# EAGLE design galgas-didacticas (EAGLE 7.5.0)
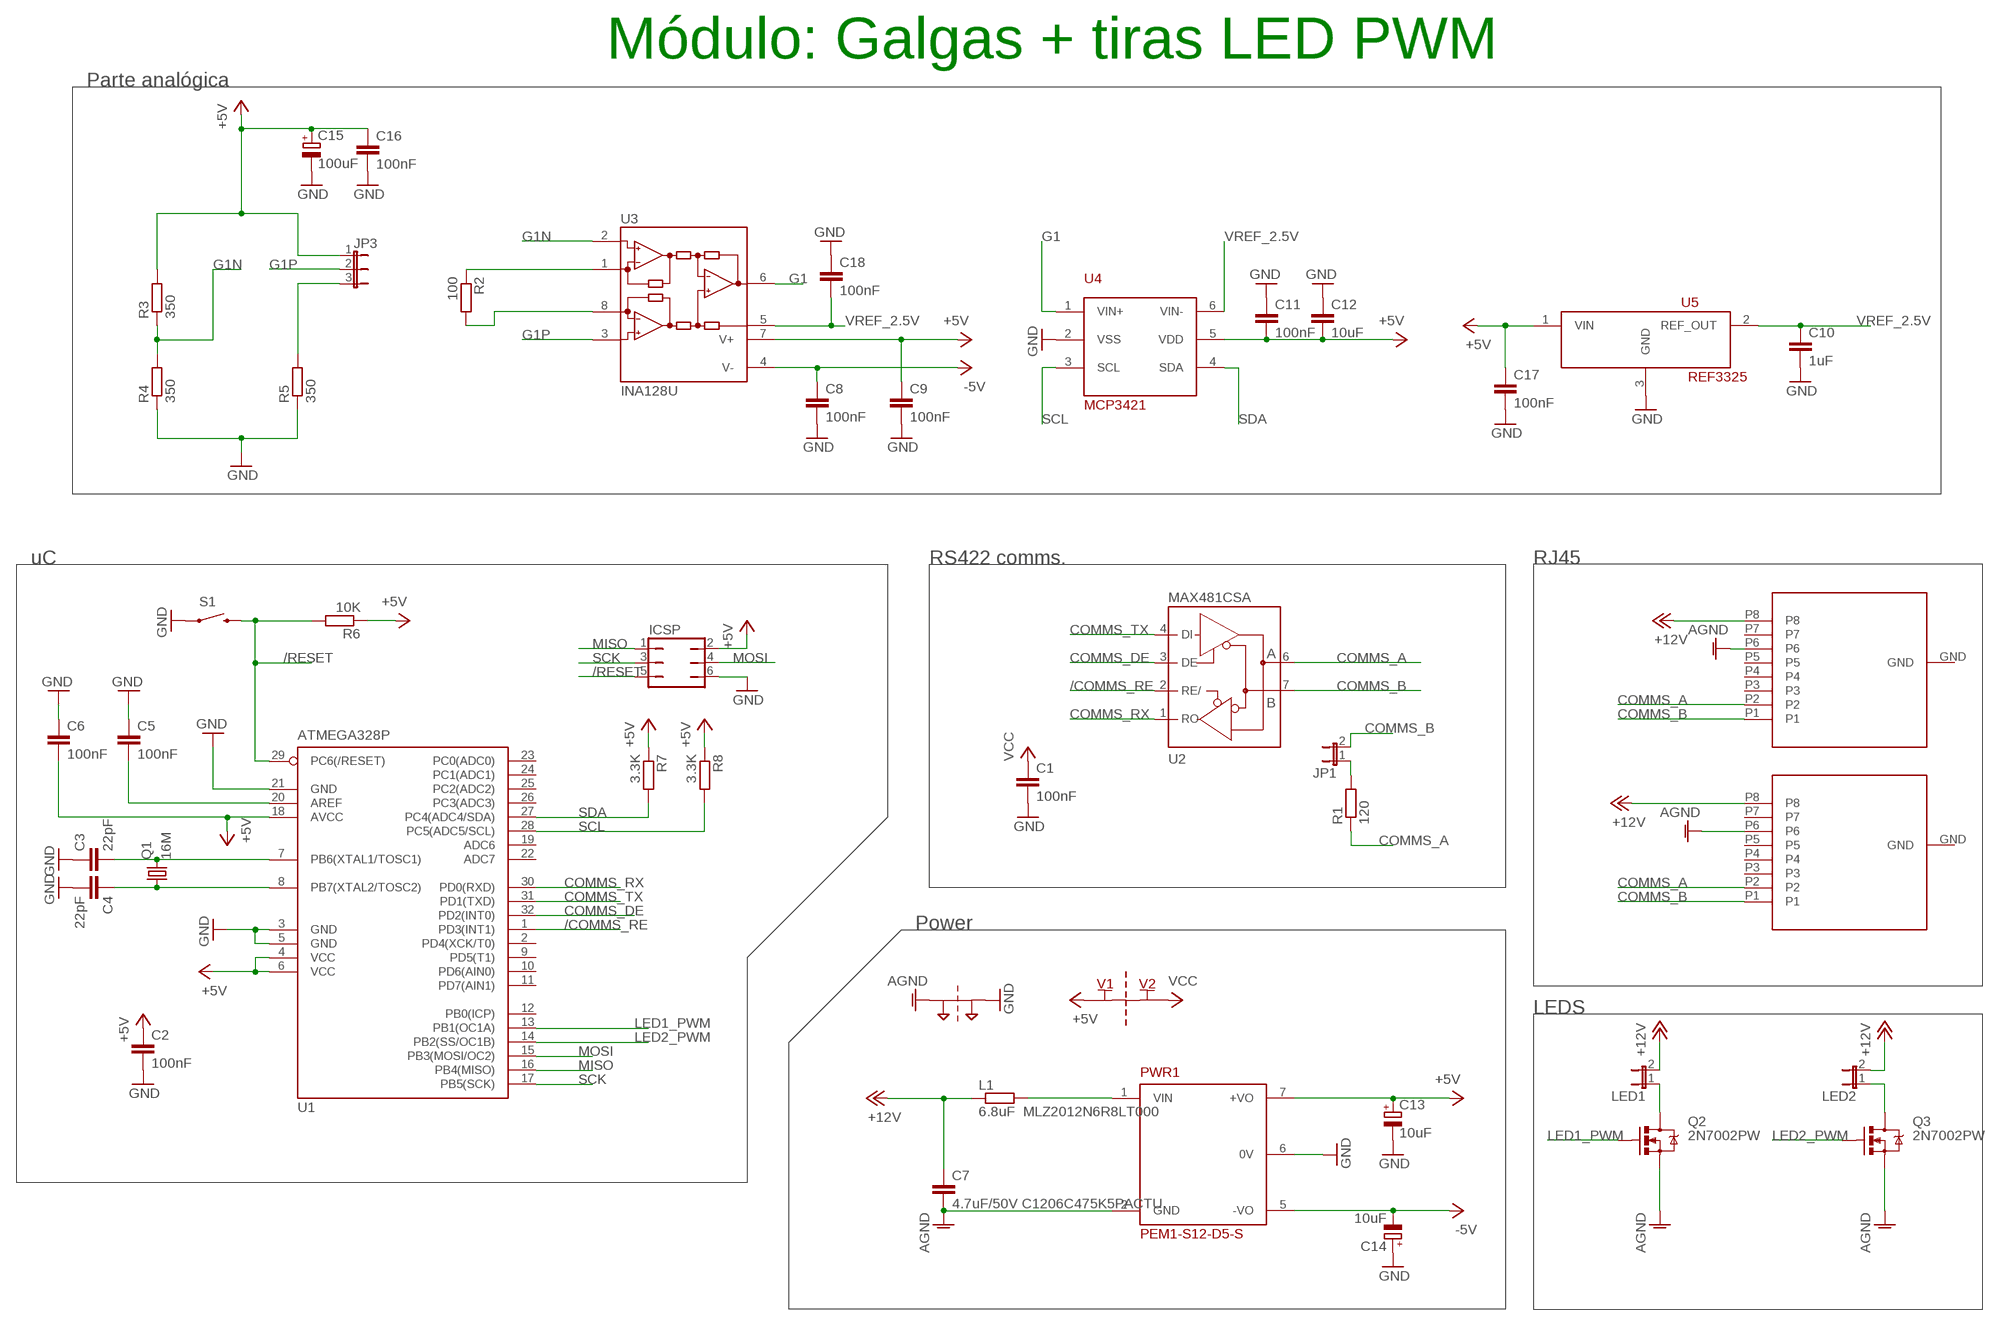
[diagram p0: schematic, sheet 1]

## Parts
C1  100nF  C-EUC0805  [C0805]
C2  100nF  C-EUC0805  [C0805]
C3  22pF  C-EUC0805  [C0805]
C4  22pF  C-EUC0805  [C0805]
C5  100nF  C-EUC0805  [C0805]
C6  100nF  C-EUC0805  [C0805]
C7  4.7uF/50V C1206C475K5PACTU  C-EUC1206K  [C1206K]
C8  100nF  C-EUC0805  [C0805]
C9  100nF  C-EUC0805  [C0805]
C10  1uF  C-EUC0805  [C0805]
C11  100nF  C-EUC0805  [C0805]
C12  10uF  C-EUC0805  [C0805]
C13  10uF  CPOL-EU153CLV-0505  [153CLV-0505]
C14  10uF  CPOL-EU153CLV-0505  [153CLV-0505]
C15  100uF  CPOL-EU153CLV-0505  [153CLV-0505]
C16  100nF  C-EUC0805  [C0805]
C17  100nF  C-EUC0805  [C0805]
C18  100nF  C-EUC0805  [C0805]
ICSP  JP3Q  [JP3Q]
J1  RJ45_DIRECT  [RJ45_DIRECT]
J2  RJ45_DIRECT  [RJ45_DIRECT]
JP1  JP1E  [JP1]
JP3  JP2E  [JP2]
L1  6.8uF MLZ2012N6R8LT000  R-EU_R0805W  [R0805W]
LED1  JP1E  [JP1]
LED2  JP1E  [JP1]
PT1  2PT_GND_TIE  [2PT_GND_TIE]
PWR1  PEM1-S12-D5-S  [PEM1-S]
Q1  16M  CRYSTALHC49UP  [HC49UP]
Q2  2N7002PW  MOSFET-NCHANNEL2N7002PW  [SOT323]
Q3  2N7002PW  MOSFET-NCHANNEL2N7002PW  [SOT323]
R1  120  R-EU_R0805W  [R0805W]
R2  100  R-EU_R0805W  [R0805W]
R3  350  R-EU_R1206W  [R1206W]
R4  350  R-EU_R1206W  [R1206W]
R5  350  R-EU_R1206W  [R1206W]
R6  10K  R-EU_R0805W  [R0805W]
R7  3.3K  R-EU_R0805W  [R0805W]
R8  3.3K  R-EU_R0805W  [R0805W]
S1  SWITCH-MOMENTARY-2PTH  [TACTILE-PTH]
U1  ATMEGA328P  MEGA8-AI  [TQFP32-08]
U2  MAX481CSA  [SO08]
U3  INA128U  [SO08]
U4  MCP3421  [SOT-23-6]
U5  REF3325  [SOT-23]
U$2  SUPPLY_CONNECT  [2PT_GND_TIE]

## Nets
+5V: C2.1 C6.2 C9.1 C11.2 C12.2 C13.+ C15.+ C16.1 C17.1 ICSP.2 JP3.1 PWR1.7(+VO) R3.2 R6.1 R7.1 R8.1 U1.4(VCC) U1.6(VCC) U1.18(AVCC) U3.7(V+) U4.5(VDD) U5.1(VIN) U$2.P$1
+12V: C7.1 J1.P8 J2.P8 L1.1 LED1.2 LED2.2
-5V: C8.1 C14.- PWR1.5(-VO) U3.4(V-)
/COMMS_RE: U1.1(PD3(INT1)) U2.2(RE/)
/RESET: ICSP.5 R6.2 S1.3 U1.29(PC6(/RESET))
AGND: C7.2 J1.P6 J2.P6 PT1.P$1 PWR1.2(GND) Q2.2(S) Q3.2(S)
COMMS_A: J1.P2 J2.P2 R1.1 U2.6(A)
COMMS_B: J1.P1 J2.P1 JP1.2 U2.7(B)
COMMS_DE: U1.32(PD2(INT0)) U2.3(DE)
COMMS_RX: U1.30(PD0(RXD)) U2.1(RO)
COMMS_TX: U1.31(PD1(TXD)) U2.4(DI)
G1: U3.6(OUT) U4.1(VIN+)
G1N: R3.1 R4.2 U3.2(-IN)
G1P: JP3.2 U3.3(+IN)
GND: C1.2 C2.2 C3.1 C4.2 C5.1 C6.1 C8.2 C9.2 C10.2 C11.1 C12.1 C13.- C14.+ C15.- C16.2 C17.2 C18.1 ICSP.6 PT1.P$2 PWR1.6(0V) R4.1 R5.1 S1.1 U1.3(GND) U1.5(GND) U1.21(GND) U4.2(VSS) U5.3(GND)
LED1_PWM: Q2.1(G) U1.13(PB1(OC1A))
LED2_PWM: Q3.1(G) U1.14(PB2(SS/OC1B))
MISO: ICSP.1 U1.16(PB4(MISO))
MOSI: ICSP.4 U1.15(PB3(MOSI/OC2))
N$1: JP1.1 R1.2
N$2: LED1.1 Q2.3(D)
N$3: C3.2 Q1.2 U1.7(PB6(XTAL1/TOSC1))
N$4: C4.1 Q1.1 U1.8(PB7(XTAL2/TOSC2))
N$5: C5.2 U1.20(AREF)
N$6: L1.2 PWR1.1(VIN)
N$7: R2.1 U3.1(RG)
N$8: R2.2 U3.8(RG)
N$9: LED2.1 Q3.3(D)
N$15: JP3.3 R5.2
SCK: ICSP.3 U1.17(PB5(SCK))
SCL: R8.2 U1.28(PC5(ADC5/SCL)) U4.3(SCL)
SDA: R7.2 U1.27(PC4(ADC4/SDA)) U4.4(SDA)
VCC: C1.1 U$2.P$2
VREF_2.5V: C10.1 C18.2 U3.5(REF) U4.6(VIN-) U5.2(REF_OUT)
Unconnected: J1.P3 J1.P4 J1.P5 J1.P7 J2.P3 J2.P4 J2.P5 J2.P7 U1.2(PD4(XCK/T0)) U1.9(PD5(T1)) U1.10(PD6(AIN0)) U1.11(PD7(AIN1)) U1.12(PB0(ICP)) U1.19(ADC6) U1.22(ADC7) U1.23(PC0(ADC0)) U1.24(PC1(ADC1)) U1.25(PC2(ADC2)) U1.26(PC3(ADC3))

## Notes on the sheet
- Módulo: Galgas + tiras LED PWM
- Parte analógica
- uC | RS422 comms. | RJ45
- Power
- LEDS

## Power pins joined to a net without a drawn wire
GND: J1.GND J2.GND U2.5(GND)
VCC: U2.8(VCC)

## Library data of the parts
C1-C12 C16-C18 = rcl:C-EU: CAPACITOR, European symbol
C13-C15 = rcl:CPOL-EU: POLARIZED CAPACITOR, European symbol
ICSP = jumper:JP3Q: JUMPER
J1 J2 = galgas_lib:RJ45_DIRECT
JP1 LED1 LED2 = jumper:JP1E: JUMPER
JP3 = jumper:JP2E: JUMPER
L1 R2 = rcl:R-EU_: RESISTOR, European symbol
PT1 = SparkFun-Passives:2PT_GND_TIE: Package for connecting two ground nets in one place.
PWR1 = galgas_lib:PEM1-S12-D5-S
Q1 = crystal:CRYSTAL: CRYSTAL; OC_FARNELL: unknown; OC_NEWARK: unknown
Q2 Q3 = SparkFun-DiscreteSemi:MOSFET-NCHANNEL: Common NMOSFET Parts MFG P/N Store ID Prod ID FDD8780 TRANS-09984 SI7820DN TRANS-11055 FDS6630A IC-08089 2N7002PW TRANS-11151 FQP30N06L COM-10213 TRANS-10060 BSS123LT1G TRANS-08345 BSS138 TRANS-00830 BS170 2N7000; PROD_ID: TRANS-11151
R1 R3-R8 = resistor:R-EU_: RESISTOR, European symbol
S1 = SparkFun-Electromechanical:SWITCH-MOMENTARY-2: Various NO switches- pushbuttons, reed, etc
U1 = atmel:MEGA8: MICROCONTROLLER 8 Kbytes FLASH, 1 kbytes SRAM, 512 bytes EEPROM, USART, 6-channel 10 bit ADC, 2-channel 8 bit ADC Pin compatible with Atmega48, ATMega88, ATMega168 Source: avr.lbr; MPN: ATMEGA8-16AU; OC_FARNELL: 9171371; OC_NEWARK: 73M8863
U2 = maxim:MAX481CSA: RS485 TRANSEIVER; MF: MAXIM; MPN: MAX481CSA; OC_FARNELL: unknown; OC_NEWARK: 90C3817
U3 = burr-brown:INA128: Instrumentation Amplifiers Precision, Low Power; MF: TEXAS INSTRUMENTS; MPN: INA128U; OC_FARNELL: 1212413; OC_NEWARK: 35C1729
U4 = galgas_lib:MCP3421: MCP3421 18-Bit Analog-to-Digital Converter with I2 C Interface and On-Board Reference
U5 = galgas_lib:REF3325
U$2 = SparkFun-Passives:SUPPLY_CONNECT

## Board
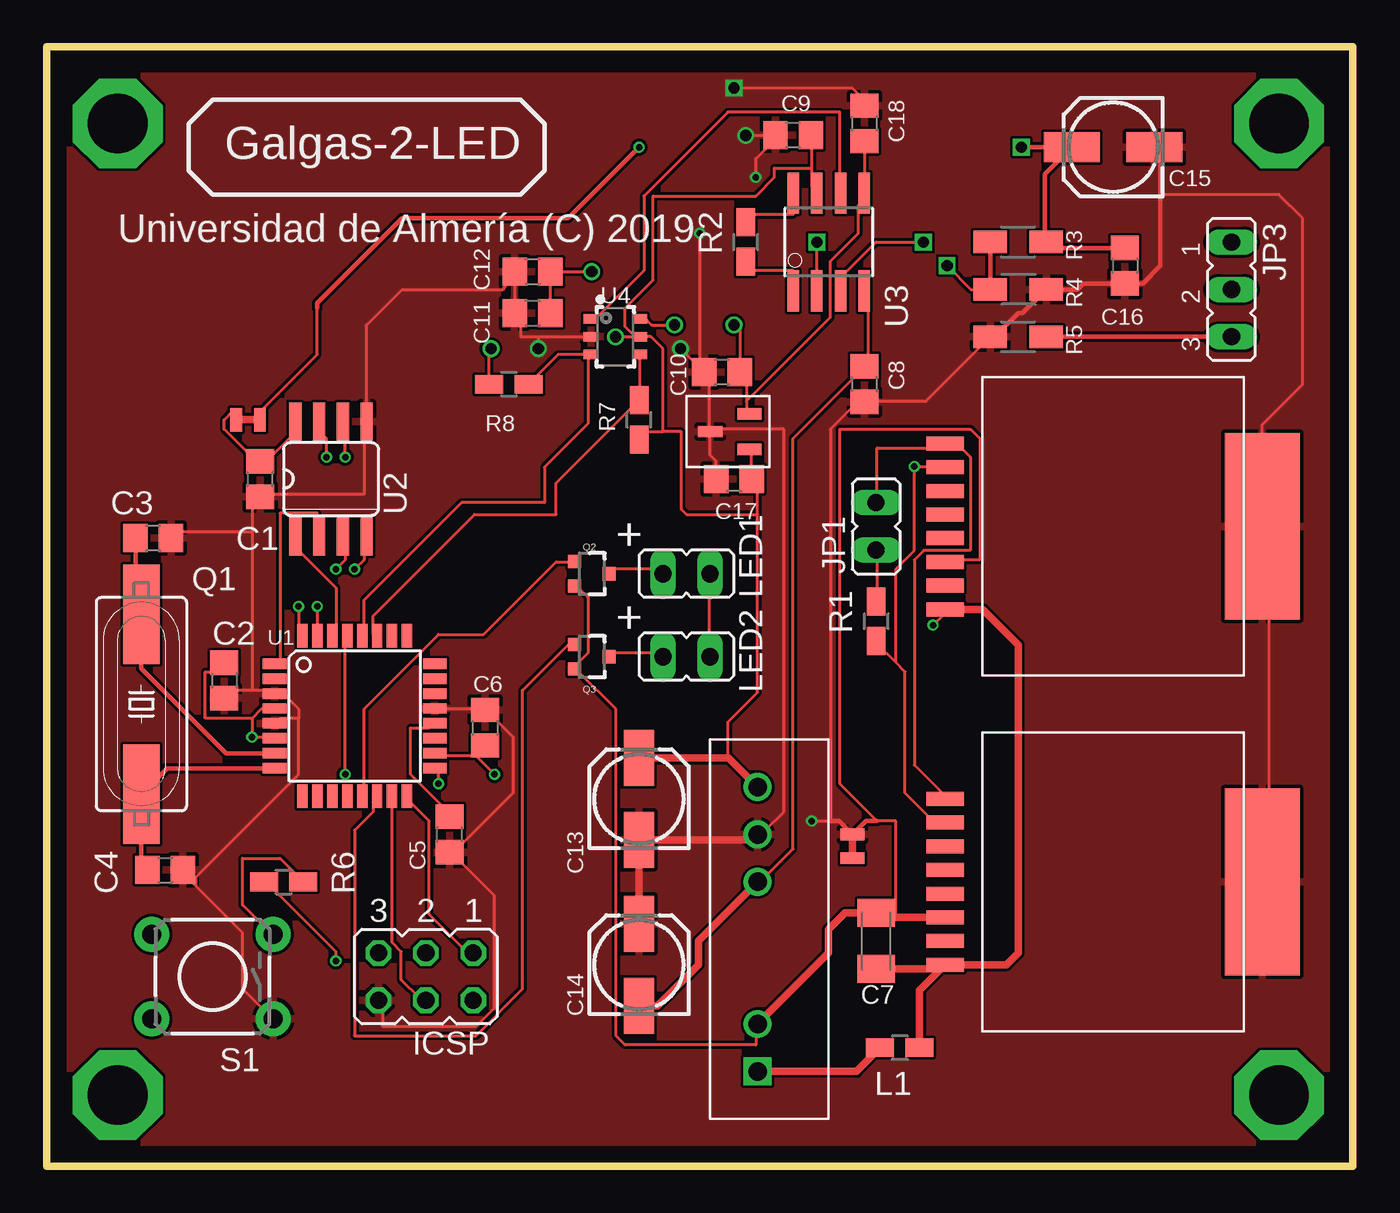
[diagram p1: board, top side]
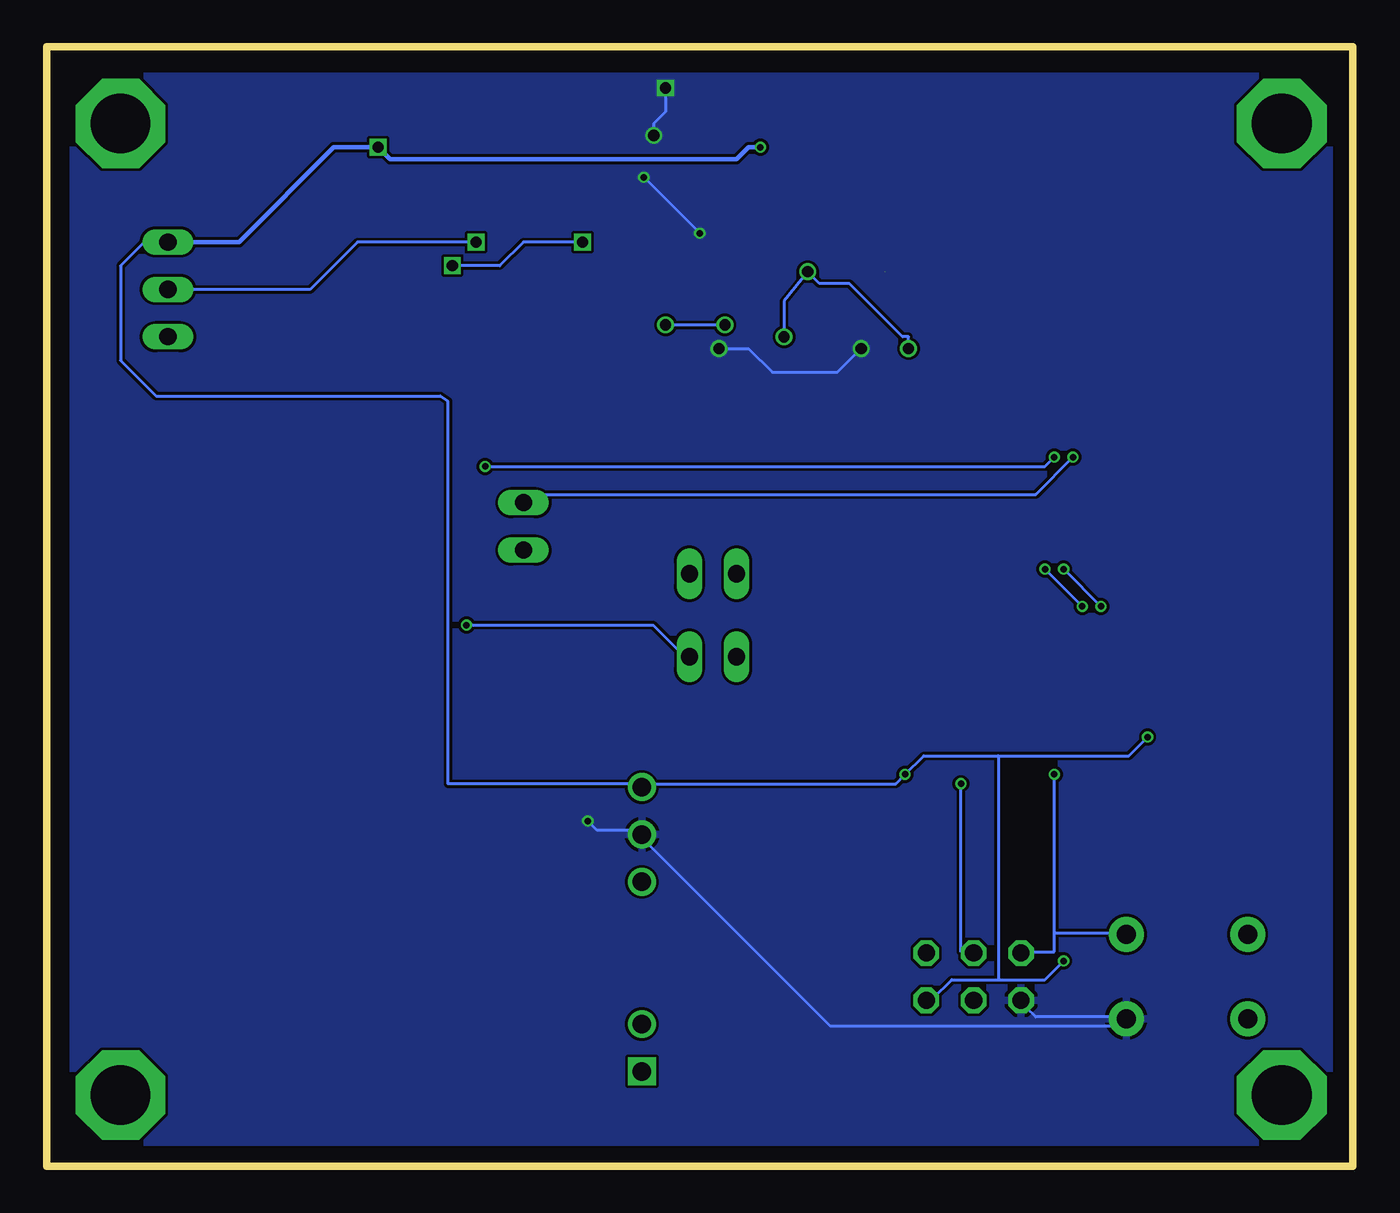
[diagram p2: board, bottom side, seen from below]

Size 70 x 60 mm. Coordinates in mm from the lower left corner, seen from the top.
Outline: 0,0 70,0 70,60 0,60 0,0
Copper layers (1*16): Top 0.018mm / dielectric 1.55mm / Bottom 0.018mm
Design rules "eC_2Layer_PClass6_BaseCopperO18_eCDefault": minimum track width 0.15mm, minimum drill 0.35mm, track to track 0.15mm, track to pad 0.15mm, pad to pad 0.15mm, via to via 0.15mm, smd to smd 0mil, copper to edge 0.25mm, drill to drill 0.35mm, minimum pad ring 0.175mm, minimum via ring 0.125mm, stop-mask expansion 0mil, vias tented up to drill 0.45mm, thermal gap 0.2mm

### Footprints (pad centres in the part's own frame; a part is rotated, then mirrored left to right if it is on the bottom)
C0805 = smd 1.3 x 1.5: 1 -0.95,0; 2 0.95,0
C1206K = smd 1.5 x 2: 1 -1.5,0; 2 1.5,0
153CLV-0505 = smd 3 x 1.6: + 2.2,0; - -2.2,0
JP3Q = drill 0.914 octagon: 1 -2.54,-1.27; 2 -2.54,1.27; 3 0,-1.27; 4 0,1.27; 5 2.54,-1.27; 6 2.54,1.27
RJ45_DIRECT = smd 4 x 10: GND 8,0 | smd 2 x 0.75: P1 -9,4.445; P2 -9,3.175; P3 -9,1.905; P4 -9,0.635; P5 -9,-0.635; P6 -9,-1.905; P7 -9,-3.175; P8 -9,-4.445
JP1 = drill 0.914 long: 1 0,-1.27; 2 0,1.27
JP2 = drill 0.914 long: 1 -2.54,0; 2 0,0; 3 2.54,0
R0805W = smd 1.5 x 1: 1 -1.052,0; 2 1.052,0
2PT_GND_TIE = smd 1.27 x 0.635: P$1 0,0.635; P$2 0,-0.635
PEM1-S = drill 0.991 square: 1 0,0 | drill 0.991: 2 2.54,0; 5 10.16,0; 6 12.7,0; 7 15.24,0
HC49UP = smd 5.334 x 1.93: 1 -4.826,0; 2 4.826,0
SOT323 = smd 0.7 x 0.7: 1 -0.65,-0.925; 2 0.65,-0.925; 3 0,0.925
R1206W = smd 1.8 x 1.2: 1 -1.499,0; 2 1.499,0
TACTILE-PTH = drill 1.016 pad 1.88: 1 -3.251,2.261; 2 3.251,2.261; 3 -3.251,-2.261; 4 3.251,-2.261
TQFP32-08 = smd 1.27 x 0.559: 1 -4.293,2.8; 2 -4.293,2; 3 -4.293,1.2; 4 -4.293,0.4; 5 -4.293,-0.4; 6 -4.293,-1.2; 7 -4.293,-2; 8 -4.293,-2.8; 17 4.293,-2.8; 18 4.293,-2; 19 4.293,-1.2; 20 4.293,-0.4; 21 4.293,0.4; 22 4.293,1.2; 23 4.293,2; 24 4.293,2.8 | smd 0.559 x 1.27: 9 -2.8,-4.293; 10 -2,-4.293; 11 -1.2,-4.293; 12 -0.4,-4.293; 13 0.4,-4.293; 14 1.2,-4.293; 15 2,-4.293; 16 2.8,-4.293; 25 2.8,4.293; 26 2,4.293; 27 1.2,4.293; 28 0.4,4.293; 29 -0.4,4.293; 30 -1.2,4.293; 31 -2,4.293; 32 -2.8,4.293
SO08 = smd 0.66 x 2.032: 1 -1.905,-3.073; 2 -0.635,-3.073; 3 0.635,-3.073; 4 1.905,-3.073; 5 1.905,3.073; 6 0.635,3.073; 7 -0.635,3.073; 8 -1.905,3.073
SO08' = smd 0.61 x 2.21: 1 -1.905,-2.616; 2 -0.635,-2.616; 3 0.635,-2.616; 4 1.905,-2.616; 5 1.905,2.616; 6 0.635,2.616; 7 -0.635,2.616; 8 -1.905,2.616
SOT-23-6 = smd 0.51 x 0.8: 1 -0.95,-1.3; 2 0,-1.3; 3 0.95,-1.3; 4 0.95,1.3; 5 0,1.3; 6 -0.95,1.3
SOT-23 = smd 1.3 x 0.6: 1 -2.1,0.95; 2 -2.1,-0.95; 3 0,0

### Placement (x,y rotation side)
C1  11.43,36.83 270 top
C2  9.53,26.04 270 top
C3  5.71,33.66 180 top
C4  6.35,15.88 0 top
C5  21.59,17.78 90 top
C6  23.5,23.5 270 top
C7  44.45,12.06 90 top
C8  43.81,41.91 270 top
C9  40.01,55.24 180 top
C10  36.2,42.55 180 top
C11  26.04,45.72 0 top
C12  26.04,47.94 0 top
C13  31.75,19.68 90 top
C14  31.75,10.79 90 top
C15  57.15,54.61 180 top
C16  57.78,48.26 270 top
C17  36.83,36.83 180 top
C18  43.81,55.88 270 top
ICSP  20.32,10.16 180 top
J1  57.15,15.24 0 top
J2  57.15,34.29 0 top
JP1  44.45,34.29 0 top
JP3  63.5,46.99 270 top
L1  45.72,6.35 180 top
LED1  34.29,31.75 270 top
LED2  34.29,27.3 270 top
PT1  43.18,17.14 180 top
PWR1  38.1,5.08 90 top
Q1  5.08,24.77 90 top
Q2  29.21,31.75 270 top
Q3  29.21,27.3 270 top
R1  44.45,29.21 90 top
R2  37.47,49.53 90 top
R3  52.07,49.53 0 top
R4  52.07,46.99 180 top
R5  52.07,44.45 0 top
R6  12.7,15.24 0 top
R7  31.75,40.01 90 top
R8  24.77,41.91 0 top
S1  8.89,10.16 180 top
U1  16.51,24.13 0 top
U2  15.24,36.83 0 top
U3  INA128U  [SO08']  41.91,49.53 0 top
U4  30.48,44.45 270 top
U5  35.56,39.37 180 top
U$2  10.79,40.01 270 top

### Tracks (layer width: path | path; a pad name or v marks a point on that pad's centre or on a via)
+5V  (via drill 0.35, 0.6)
  Top 0.15: U$2.P$1 11.5,40.5 14.5,43.5 14.5,46 | 53.5,49.96 R3.2 | 41,53.5 41,52.5 U3.7 | 41,53.5 41,55 C9.1 | 32,44.5 U4.5 | 37.5,38.5 U5.1 37.78,38.3 C17.1 38.1,36.51 38.1,34.92 | 41,53.5 39,53.5 39,53 38,52 32.5,52 32.5,47.5 31,46 31,45 31.5,44.5 U4.5 | v15.5,11 15.5,11.5 12,15 R6.1 | 11,24 v11,23 12,23 U1.6 | 11,24 11.5,24.5 12,24.5 U1.4 | 11,24 8.5,24 8.5,26.5 9.5,26.5 C2.1 | 23,22 21,22 U1.18 | 23,22 23,22.5 C6.2 23,22 | v24,21 23,22 | 36.5,21.89 36.5,23.8 38.1,25.4 38.1,34.92 | 38.1,34.92 34.29,34.92 34,35.22 34,39.37 33.02,39.37 | R7.1 32.17,39.37 33.02,39.37 | v29.21,47.94 C12.2 C11.2 | v30.48,44.45 U4.5 | 33.02,39.37 33.02,43.81 32.38,44.45 U4.5 | R8.1 23.71,43.72 v23.81,43.81
  Top 0.25: v52.23,54.61 C15.+ 53.5,53.16 53.5,49.96 | R3.2 53.89,49.21 C16.1
  Top 0.254: 14.5,46 14.5,46.25 19.05,50.8 27.94,50.8 v31.75,54.61
  Top 0.406: C13.+ 36.5,21.89 36.53,21.89 PWR1.7
  Bottom 0.15: v15.5,11 16.5,10 19,10 | 19,10 21.5,10 22.5,9 ICSP.2 | v11,23 12,22 19,22 | 19,22 23,22 v24,21 24.5,20.5 38,20.5 PWR1.7 38.5,20.5 48.5,20.5 48.5,41 48.9,41.27 64.14,41.27 66.04,43.18 66.04,48.26 64.77,49.53 JP3.1 | 19,22 19,10 | v30.48,44.45 30.48,46.35 v29.21,47.94 28.57,47.31 26.98,47.31 24.13,44.45 23.81,44.45 v23.81,43.81
  Bottom 0.25: JP3.1 59.69,49.53 54.61,54.61 v52.23,54.61 51.59,53.98 33.02,53.98 32.38,54.61 v31.75,54.61
+12V  (via drill 0.35)
  Top 0.15: LED2.2 35.5,27.5 35.5,31.5 LED1.2 | v47.5,29 48,29.5 J2.P8
  Top 0.406: J2.P8 50.16,29.84 52.07,27.94 52.07,11.43 51.44,10.79 J1.P8 47.92,10.56 | 47.92,10.56 C7.1 | 47.92,10.56 46.77,9.42 L1.1
  Bottom 0.15: v47.5,29 37.5,29 36,27.5 LED2.2
-5V
  Top 0.15: U3.4 44,46.5 44,43 C8.1 43.5,42.5 40,39 40,17 38.5,15.5 PWR1.5
  Top 0.406: C14.- 32.73,8.6 34.92,10.79 34.92,12.06 PWR1.5
/COMMS_RE
  Top 0.15: U1.1 12.5,27 12.5,35 14.5,35 14.5,34 U2.2
/RESET  (via drill 0.35)
  Top 0.15: R6.2 13.5,15.5 12.5,16.5 10.5,16.5 10.5,14 12,12.5 S1.3 | v16,21 16,28 U1.29
  Bottom 0.15: 16,12.5 16,11.5 17.5,11.5 ICSP.5 | 16,12.5 v16,21 | 16,12.5 12.5,12.5 S1.3
AGND
  Top 0.15: Q2.2 28.5,31 29,30.5 29,27.5 28.5,27 Q3.2 28.5,26.5 30.5,24.5 30.5,7 31,6.5 38,6.5 38,7.5 PWR1.2 | 45.5,13.34 45.5,18.5 44.5,18.5 42.5,20.5 42.5,39.5 49.5,39.5 50,39 50,32.5 48.5,32.5 J2.P6
  Top 0.254: 44.5,18.5 43.9,18.5 43.18,17.78
  Top 0.406: PWR1.2 41.91,11.43 41.91,12.7 42.77,13.56 C7.2 arc90 44.68,13.34 45.5,13.34 J1.P6
COMMS_A  (via drill 0.35)
  Top 0.15: 45.5,27 46,26.5 46,20 47.5,18.5 48,18.5 J1.P2 | 45.5,27 44.5,28 R1.1 | 45.5,27 45.5,32 46.5,33 v46.5,37.5 48,37.5 J2.P2 | v16,38 16,39.5 U2.6
  Bottom 0.15: v16,38 16.5,37.5 v46.5,37.5
COMMS_B  (via drill 0.35)
  Top 0.15: J1.P1 48,20 46.5,21.5 46.5,32.5 47,33 49.5,33 49.5,38 48.5,39 J2.P1 48,38.5 44.5,38.5 44.5,36 JP1.2 | v15,38 15,39 14.5,39.5 U2.7
  Bottom 0.15: v15,38 17,36 44,36 JP1.2
COMMS_DE  (via drill 0.35)
  Top 0.15: v13.5,30 13.5,28.5 U1.32 | v15.5,32 16,32.5 16,33.5 U2.3
  Bottom 0.15: v15.5,32 v13.5,30
COMMS_RX
  Top 0.15: U1.30 15.5,28.5 15.5,31 13.5,33 13.5,33.5 U2.1
COMMS_TX  (via drill 0.35)
  Top 0.15: v14.5,30 14.5,28.5 U1.31 | v16.5,32 17,32.5 17,33.5 U2.4
  Bottom 0.15: v16.5,32 v14.5,30
G1
  Top 0.15: U4.1 29.5,45.5 32,48 32,52 36.5,56.5 42.5,56.5 42.5,52.5 U3.6
G1N  (via drill 0.6)
  Top 0.15: U3.2 v41.27,49.53 | v48.26,48.26 49.53,46.99 R4.2
  Top 0.254: R4.2 R3.1
  Bottom 0.15: v41.27,49.53 44.45,49.53 45.72,48.26 v48.26,48.26
G1P  (via drill 0.6)
  Top 0.15: U3.3 42.55,47.62 44.45,49.53 v46.99,49.53
  Bottom 0.15: v46.99,49.53 53.34,49.53 55.88,46.99 JP3.2
GND  (via drill 0.35, 0.6)  (1 unrouted)
  Top 0.15: 50.5,43.96 R5.1 | 65.5,32 65.5,34 J2.GND | 65.5,32 65.5,15.5 J1.GND | 51,43.96 R5.1 | 65.5,32 J2.GND | 13.5,24 12.5,24 U1.5 | 13.5,24 13.5,24.5 12.5,25.5 U1.3 12,25.5 11,25.5 | 11,25.5 10,25.5 C2.2 | 11,34 7,34 C3.1 | 11,34 11,35.5 C1.2 11.5,36 17,36 17,39.5 U2.5 17,40 17.14,40.15 17.14,45.09 19.05,46.99 24.45,46.99 C12.1 | 11,34 11,25.5 | 29,44.5 U4.2 26.35,44.45 | U5.3 35.5,39.5 35.5,42.5 C10.2 35,43 | v38,53 38,54 39,55 C9.2 v37.47,55.24 | 35,43 v35,50 | U1.21 21,24.5 23,24.5 C6.1 23.5,24.5 25,23 25,20 22,17 C5.1 22,16.5 24,14.5 24,8.5 23,7.5 18,7.5 18,8.5 ICSP.6 | 8,15 10.5,12.5 10.5,9.5 12,8 S1.1 | 8,15 7.5,15.5 C4.2 | U5.3 36,39.5 39.5,39.5 39.5,19 38.5,18 PWR1.6 | 13.5,24 13.5,21 8,15.5 8,15 | v41,18.5 42,18.5 42,39.5 43.5,41 C8.2 44,41 47.12,41 R5.1 | J2.GND 65.15,39.75 67.31,41.91 67.31,50.8 66.04,52.07 59.69,52.07 | C17.2 35.88,37.78 35.56,38.1 U5.3 | C18.1 43.81,57.15 43.18,57.78 v36.83,57.78 | C11.1 25.4,45.41 25.4,44.45 26.35,44.45 | 35,43 34.79,43 v33.97,43.81 | v26.35,43.81 26.35,44.45 | C12.1 C11.1
  Top 0.25: R4.1 55.24,46.99 55.56,47.31 C16.2 58.74,47.31 59.69,48.26 59.69,52.07 59.69,54.27 C15.-
  Top 0.254: R5.1 50.8,44.45 52.07,45.72 52.3,45.72 R4.1 | 42,18.5 42.46,18.5 PT1.P$2
  Top 0.406: PWR1.6 37.8,17.48 C13.- C14.+
  Bottom 0.15: v35,50 v38,53 | ICSP.6 17.5,8.5 17,8 12.5,8 S1.1 12.5,7.5 28,7.5 38,17.5 PWR1.6 38.5,18 40.5,18 v41,18.5 | v36.83,57.78 36.83,56.52 37.47,55.88 v37.47,55.24 | v33.97,43.81 32.38,43.81 31.11,42.55 27.62,42.55 v26.35,43.81
  pour Bottom: 2.54,58.42 68.58,58.42 68.58,1.27 1.27,1.27 1.27,58.42
  pour Top: 1.27,58.42 68.58,58.42 68.58,1.27 1.27,1.27
LED1_PWM
  Top 0.15: 28,32.5 Q2.1 28.27,32.38 27.3,32.38 23.42,28.5 21,28.5 17,24.5 17,20 U1.13
LED2_PWM
  Top 0.15: Q3.1 28,28 25.5,25.5 25.5,9.5 23,7 16.5,7 16.5,18 17.5,19 17.5,19.5 U1.14
MISO
  Top 0.15: U1.16 19.5,19.5 20.5,18.5 20.5,13.5 22.5,11.5 ICSP.1
MOSI
  Top 0.15: U1.15 18.5,19.5 18.5,12 19,11.5 19,10 20,9 ICSP.4
N$1
  Top 0.15: R1.2 44.5,30.5 44.5,33 JP1.1
N$2
  Top 0.15: Q2.3 30,32 33,32 LED1.1
N$3
  Top 0.254: U1.7 9.62,22.13 5.08,26.67 Q1.2 4.76,29.91 C3.2
N$4
  Top 0.254: U1.8 6.47,21.33 Q1.1 5.08,16.2 C4.1
N$5
  Top 0.15: U1.20 20.5,23.5 19.5,23.5 19.5,21 21.5,19 C5.2
N$6
  Top 0.406: L1.2 43.4,5.08 PWR1.1
N$7
  Top 0.15: R2.1 37.5,48 40,48 40,47 U3.1
N$8
  Top 0.15: R2.2 37.5,51 40,51 40,52 U3.8
N$9
  Top 0.15: Q3.3 30,27.5 33,27.5 LED2.1
N$10  (via drill 3.2)
  other vias: 3.81,55.88
N$11  (via drill 3.2)
  other vias: 66.04,55.88
N$12  (via drill 3.2)
  other vias: 3.81,3.81
N$13  (via drill 3.2)
  other vias: 66.04,3.81
N$15
  Top 0.254: JP3.3 R5.2
SCK  (via drill 0.35)
  Top 0.15: v21,20.5 21,21.5 U1.17
  Bottom 0.15: v21,20.5 21,11.5 20.5,11.5 ICSP.3
SCL
  Top 0.15: 29,43.5 U4.3 | U1.28 17,28.5 17,30.34 22.23,35.56 26.67,35.56 26.67,37.47 29,39.8 29,43.5 | 29,43.5 27.41,43.5 R8.2
SDA
  Top 0.15: 31.5,43.5 U4.4 31.78,41.09 R7.2 27.3,36.61 27.3,34.92 22.93,34.92 17.5,29.5 17.5,28.5 U1.27
VCC
  Top 0.15: U$2.P$2 10,40.5 9.5,40 9.5,39.5 11,38 C1.1 11.5,37.5 13.5,39.5 U2.8
VREF_2.5V  (via drill 0.6)
  Top 0.15: U4.6 32,45.5 32.41,45.09 v33.66,45.09 | 37,43 C10.1 | 37.5,41 37.5,42.5 C10.1 | 37.5,41 37.5,40.5 U5.2 | 37.5,41 42,45.5 42,48.5 43.5,50 43.5,51.5 44,52 U3.5 C18.2 | v36.83,45.09 37.15,44.77 C10.1
  Bottom 0.15: v33.66,45.09 v36.83,45.09

### Text on the board
tNames: Galgas-2-LED | Universidad de Almería (C) 2019 | + | +